# Altium schematic sheet PWrinSpace_template_sheet.SchDoc
size A4; SheetNumber: 1; SheetTotal: 1
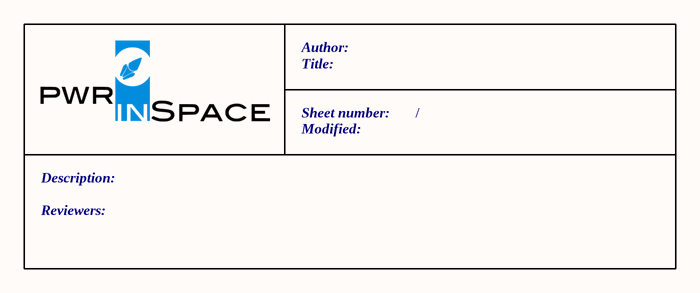
[diagram p0: PWrinSpace_template_sheet.SchDoc]

## Notes on the sheet
- Author:
- Title:
- Sheet number:
- Modified:
- /
- Description:
- Reviewers: